# EAGLE board en_v5 (EAGLE 9.6.2), part 1 of 2
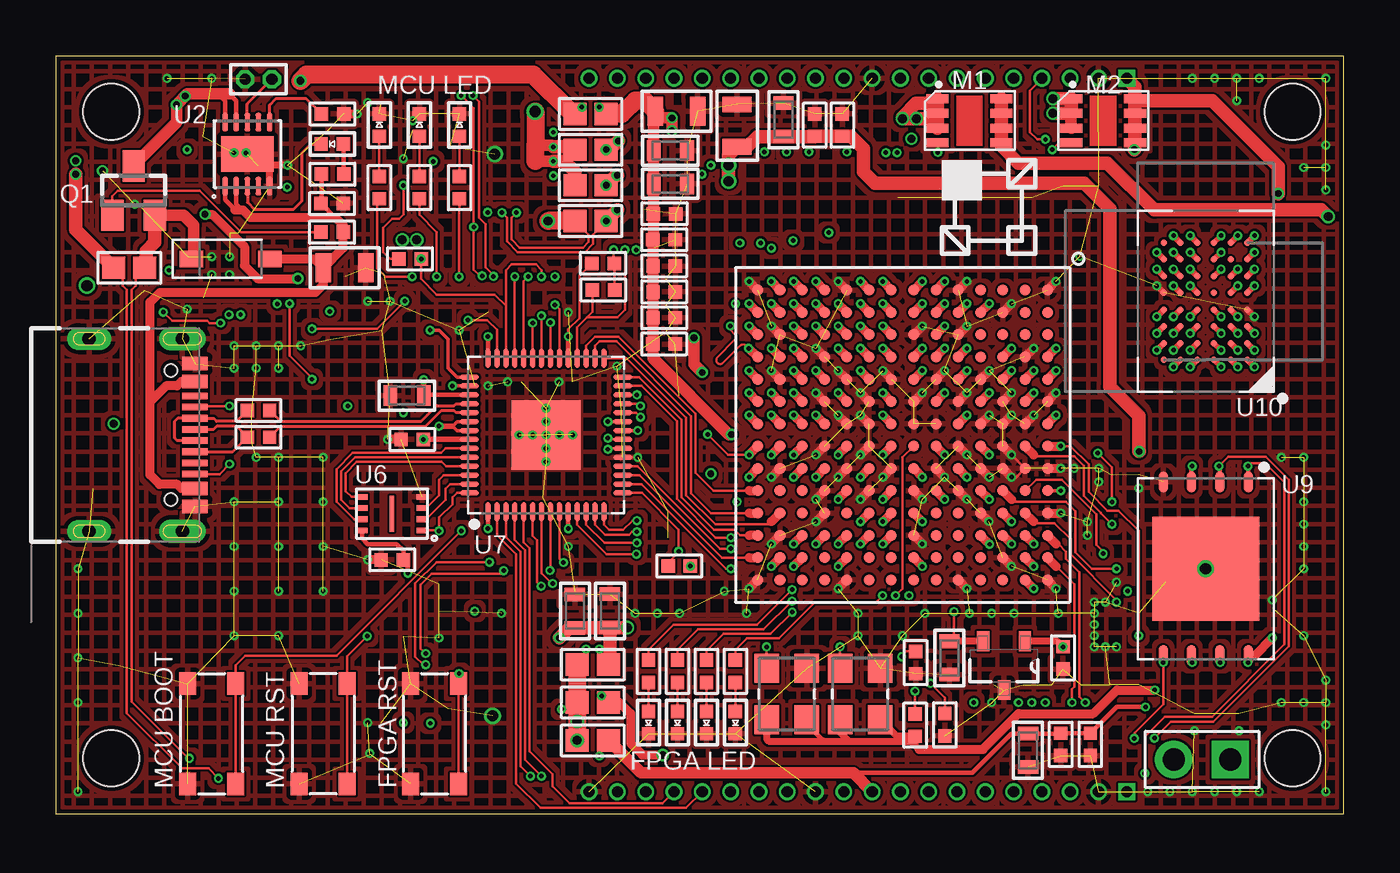
[diagram p6: board, top side]
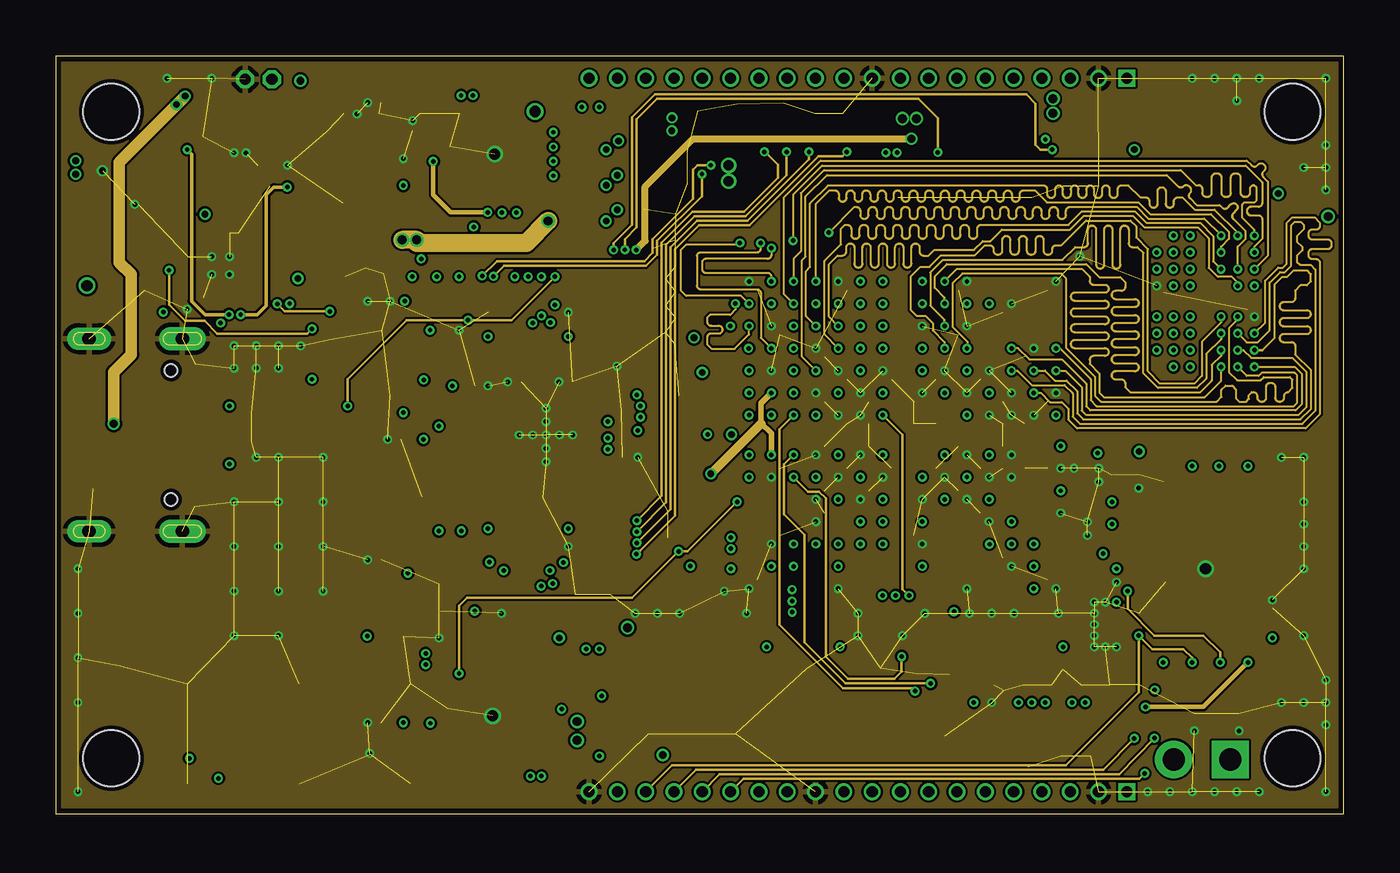
[diagram p7: board, inner layer Route2]
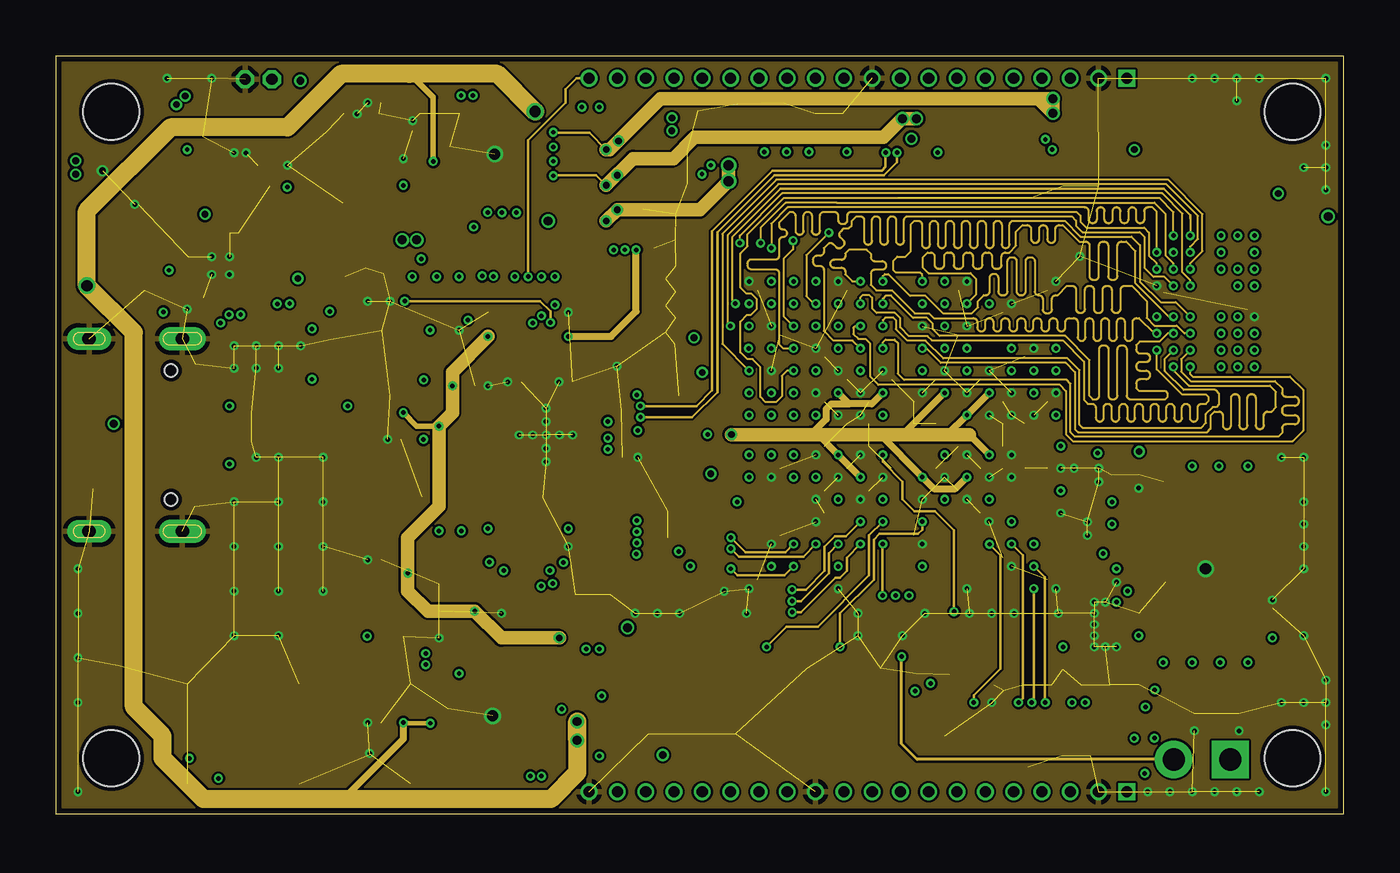
[diagram p8: board, inner layer Route3]
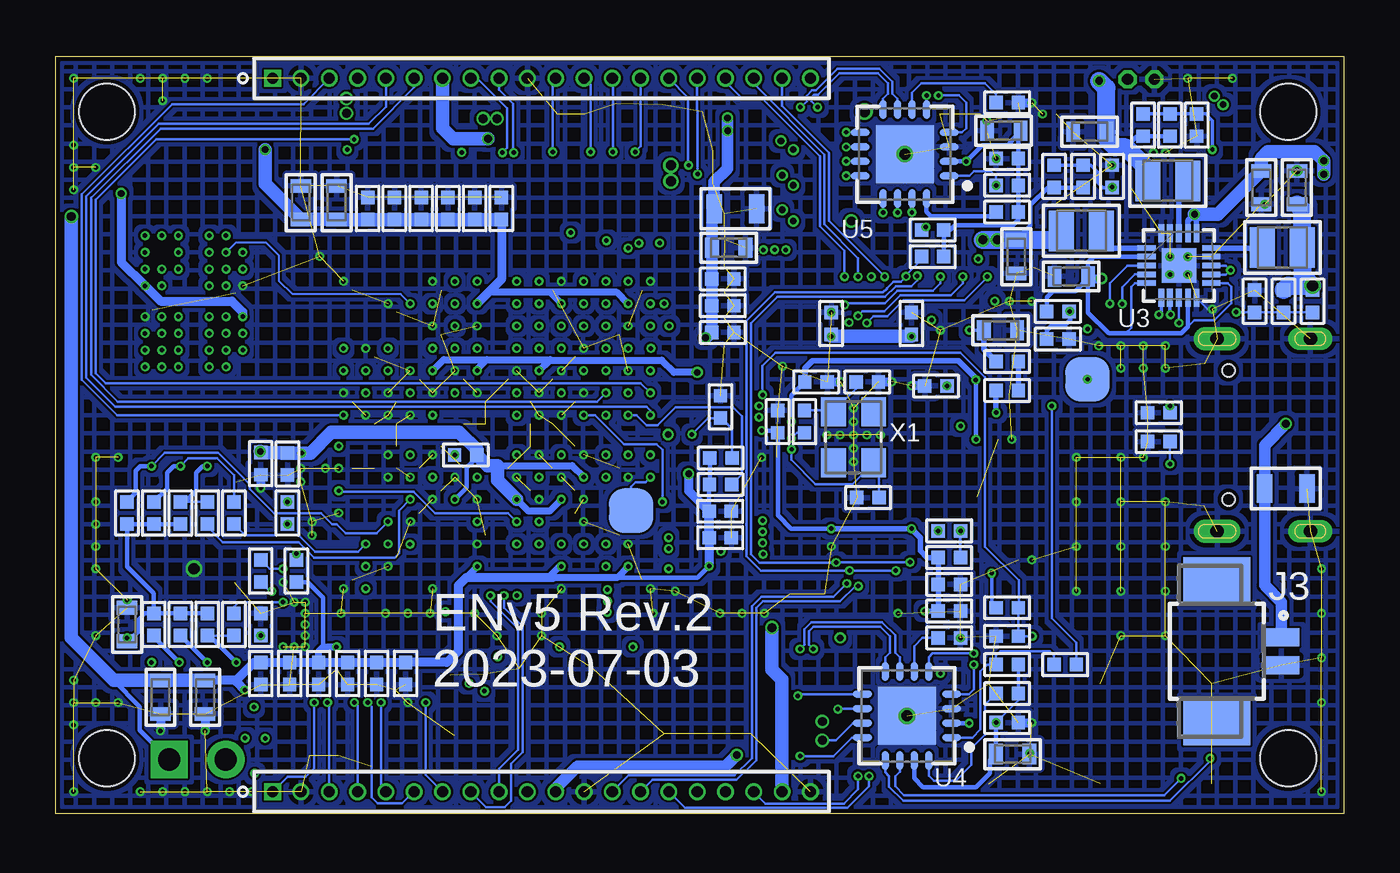
[diagram p9: board, bottom side, seen from below]

Size 57.8 x 34 mm. Coordinates in mm from the lower left corner, seen from the top.
Outline: 0,0 57.8,0 57.8,34 0,34 0,0
Copper layers (1+2*3+16): Top 0.018mm / dielectric 0.36mm / Route2 0.035mm / dielectric 0.71mm / Route3 0.035mm / dielectric 0.36mm / Bottom 0.018mm
Design rules "Multi-CB_4L_100Êm-Tracks_OL35Êm-IL35Êm": minimum track width 0.1mm, minimum drill 0.2mm, track to track 0.1mm, track to pad 0.1mm, pad to pad 0.1mm, via to via 0.1mm, smd to smd 0mil, copper to edge 0.2mm, drill to drill 0.2mm, minimum pad ring 0.125mm, minimum via ring 0.1mm, stop-mask expansion 2mil, vias tented up to drill 0.45mm, thermal gap 0.2mm
Net classes: 1 diff pairs: width 0.102 mm
Holes 2.5 mm at 2.5,31.5 2.5,2.5 55.5,31.5 55.5,2.5

## Footprints (pad centres in the part's own frame; a part is rotated, then mirrored left to right if it is on the bottom)
0805 = smd 0.7 x 1.3: 1 -0.95,0; 2 0.95,0
0402 = smd 0.6 x 0.6: 1 -0.5,0; 2 0.5,0
CAPC1608-0603 = smd 0.611 x 0.912: 1 -0.751,0; 2 0.751,0
SOD-123 = smd 1.046 x 0.739: 1 -1.762,0; 2 1.762,0
20X1_HEADER_THT_1.27MM = drill 0.5 pad 0.61 square: 1 -12.065,0 | drill 0.5 pad 0.61: 2 -10.795,0; 3 -9.525,0; 4 -8.255,0; 5 -6.985,0; 6 -5.715,0; 7 -4.445,0; 8 -3.175,0; 9 -1.905,0; 10 -0.635,0; 11 0.635,0; 12 1.905,0; 13 3.175,0; 14 4.445,0; 15 5.715,0; 16 6.985,0; 17 8.255,0; 18 9.525,0; 19 10.795,0; 20 12.065,0
MOLEX_53261-0271 = smd 0.8 x 1.6: 1 -0.625,2.9; 2 0.625,2.9 | smd 2.1 x 3: P1 -3.175,0; P2 3.175,0
GCT_USB4105-GF-A = smd 0.6 x 1.15: A1_B12 -3.2,4.755; A4_B9 -2.4,4.755; B1_A12 3.2,4.755; B4_A9 2.4,4.755 | smd 0.3 x 1.15: A5 -1.25,4.755; A6 -0.25,4.755; A7 0.25,4.755; A8 1.25,4.755; B5 1.75,4.755; B6 0.75,4.755; B7 -0.75,4.755; B8 -1.75,4.755 | drill 0.6 pad 1.05 long: S1 -4.32,4.18; S4 4.32,4.18 | drill 0.6 pad 1 long: S2 -4.32,0; S3 4.32,0 | hole 0.55: 2.89,3.68; -2.89,3.68
2X1_HEADER = drill 1 pad 1.676 square: 1 0,3.81 | drill 1 pad 1.676: 3 0,1.27
INDC2016X120N = smd 1.121 x 1.815: 1 -0.897,0; 2 0.897,0
POWERPAK1212-8 = smd 0.405 x 0.99: 1 -0.99,-1.435; 2 -0.33,-1.435; 3 0.33,-1.435; 4 0.99,-1.435; 5 0.99,1.435; 6 0.33,1.435; 7 -0.33,1.435; 8 -0.99,1.435
SSOT-3 = smd 1 x 1.4: 1 -0.95,-1.1; 2 0.95,-1.1; 3 0,1.1
THT_2 = drill 0.5 pad 0.813 octagon: P$1 -0.6,0; P$2 0.6,0
0603 = smd 1.029 x 0.999: 1 -0.7,0; 2 0.7,0
TACTILE-SWITCH = smd 1 x 0.75: 1 -2.25,-1.075; 2 2.25,-1.075; 3 -2.25,1.075; 4 2.25,1.075
SMD_PAD = smd 2 x 2: 1 0,0
SOT-23(3PIN) = smd 0.559 x 0.889: 1 -0.94,-1.092; 2 0.94,-1.092; 3 0,1.092
DFN-10(3X3X0.9) = smd 0.84 x 0.26: 1 -1.435,1; 2 -1.435,0.5; 3 -1.435,0; 4 -1.435,-0.5; 5 -1.435,-1; 6 1.435,-1; 7 1.435,-0.5; 8 1.435,0; 9 1.435,0.5; 10 1.435,1 | smd 1.58 x 2.35: 11 0,0
QFN40P300X300X80-21N = smd 0.813 x 0.254: 1 -1.448,0.787; 2 -1.448,0.406; 3 -1.448,0; 4 -1.448,-0.406; 5 -1.448,-0.787; 11 1.448,-0.787; 12 1.448,-0.406; 13 1.448,0; 14 1.448,0.406; 15 1.448,0.787 | smd 0.254 x 0.813: 6 -0.787,-1.448; 7 -0.406,-1.448; 8 0,-1.448; 9 0.406,-1.448; 10 0.787,-1.448; 16 0.787,1.448; 17 0.406,1.448; 18 0,1.448; 19 -0.406,1.448; 20 -0.787,1.448 | smd 1.549 x 1.549: 21 0,0
UQFN-16(4×4×0.5MM) = smd 0.86 x 0.32: 1 -2,0.975; 2 -2,0.325; 3 -2,-0.325; 4 -2,-0.975; 9 2,-0.975; 10 2,-0.325; 11 2,0.325; 12 2,0.975 | smd 0.32 x 0.86: 5 -0.975,-2; 6 -0.325,-2; 7 0.325,-2; 8 0.975,-2; 13 0.975,2; 14 0.325,2; 15 -0.325,2; 16 -0.975,2 | smd 2.6 x 2.6: 17 0,0
USON8-2X3MM = smd 0.5 x 0.25: 1 -1.35,0.75; 2 -1.35,0.25; 3 -1.35,-0.25; 4 -1.35,-0.75; 5 1.35,-0.75; 6 1.35,-0.25; 7 1.35,0.25; 8 1.35,0.75 | smd 0.2 x 1.6: 9 0,0
QFN40P700X700X100-57T310N = smd 0.858 x 0.218: 1 -3.442,2.6; 2 -3.442,2.2; 3 -3.442,1.8; 4 -3.442,1.4; 5 -3.442,1; 6 -3.442,0.6; 7 -3.442,0.2; 8 -3.442,-0.2; 9 -3.442,-0.6; 10 -3.442,-1; 11 -3.442,-1.4; 12 -3.442,-1.8; 13 -3.442,-2.2; 14 -3.442,-2.6; 29 3.442,-2.6; 30 3.442,-2.2; 31 3.442,-1.8; 32 3.442,-1.4; 33 3.442,-1; 34 3.442,-0.6; 35 3.442,-0.2; 36 3.442,0.2; 37 3.442,0.6; 38 3.442,1; 39 3.442,1.4; 40 3.442,1.8; 41 3.442,2.2; 42 3.442,2.6 | smd 0.218 x 0.858: 15 -2.6,-3.442; 16 -2.2,-3.442; 17 -1.8,-3.442; 18 -1.4,-3.442; 19 -1,-3.442; 20 -0.6,-3.442; 21 -0.2,-3.442; 22 0.2,-3.442; 23 0.6,-3.442; 24 1,-3.442; 25 1.4,-3.442; 26 1.8,-3.442; 27 2.2,-3.442; 28 2.6,-3.442; 43 2.6,3.442; 44 2.2,3.442; 45 1.8,3.442; 46 1.4,3.442; 47 1,3.442; 48 0.6,3.442; 49 0.2,3.442; 50 -0.2,3.442; 51 -0.6,3.442; 52 -1,3.442; 53 -1.4,3.442; 54 -1.8,3.442; 55 -2.2,3.442; 56 -2.6,3.442 | smd 3.1 x 3.1: 57 0,0
FTGB196 = smd 0.5 x 0.5: A1 -6.5,6.5; A2 -5.5,6.5; A3 -4.5,6.5; A4 -3.5,6.5; A5 -2.5,6.5; A6 -1.5,6.5; A7 -0.5,6.5; A8 0.5,6.5; A9 1.5,6.5; A10 2.5,6.5; A11 3.5,6.5; A12 4.5,6.5; A13 5.5,6.5; A14 6.5,6.5; B1 -6.5,5.5; B2 -5.5,5.5; B3 -4.5,5.5; B4 -3.5,5.5; B5 -2.5,5.5; B6 -1.5,5.5; B7 -0.5,5.5; B8 0.5,5.5; B9 1.5,5.5; B10 2.5,5.5; B11 3.5,5.5; B12 4.5,5.5; B13 5.5,5.5; B14 6.5,5.5; C1 -6.5,4.5; C2 -5.5,4.5; C3 -4.5,4.5; C4 -3.5,4.5; C5 -2.5,4.5; C6 -1.5,4.5; C7 -0.5,4.5; C8 0.5,4.5; C9 1.5,4.5; C10 2.5,4.5; C11 3.5,4.5; C12 4.5,4.5; C13 5.5,4.5; C14 6.5,4.5; D1 -6.5,3.5; D2 -5.5,3.5; D3 -4.5,3.5; D4 -3.5,3.5; D5 -2.5,3.5; D6 -1.5,3.5; D7 -0.5,3.5; D8 0.5,3.5; D9 1.5,3.5; D10 2.5,3.5; D11 3.5,3.5; D12 4.5,3.5; D13 5.5,3.5; D14 6.5,3.5; E1 -6.5,2.5; E2 -5.5,2.5; E3 -4.5,2.5; E4 -3.5,2.5; E5 -2.5,2.5; E6 -1.5,2.5; E7 -0.5,2.5; E8 0.5,2.5; E9 1.5,2.5; E10 2.5,2.5; E11 3.5,2.5; E12 4.5,2.5; E13 5.5,2.5; E14 6.5,2.5; F1 -6.5,1.5; F2 -5.5,1.5; F3 -4.5,1.5; F4 -3.5,1.5; F5 -2.5,1.5; F6 -1.5,1.5; F7 -0.5,1.5; F8 0.5,1.5; F9 1.5,1.5; F10 2.5,1.5; F11 3.5,1.5; F12 4.5,1.5; F13 5.5,1.5; F14 6.5,1.5; G1 -6.5,0.5; G2 -5.5,0.5; G3 -4.5,0.5; G4 -3.5,0.5; G5 -2.5,0.5; G6 -1.5,0.5; G7 -0.5,0.5; G8 0.5,0.5; G9 1.5,0.5; G10 2.5,0.5; G11 3.5,0.5; G12 4.5,0.5; G13 5.5,0.5; G14 6.5,0.5; H1 -6.5,-0.5; H2 -5.5,-0.5; H3 -4.5,-0.5; H4 -3.5,-0.5; H5 -2.5,-0.5; H6 -1.5,-0.5; H7 -0.5,-0.5; H8 0.5,-0.5; H9 1.5,-0.5; H10 2.5,-0.5; H11 3.5,-0.5; H12 4.5,-0.5; H13 5.5,-0.5; H14 6.5,-0.5; J1 -6.5,-1.5; J2 -5.5,-1.5; J3 -4.5,-1.5; J4 -3.5,-1.5; J5 -2.5,-1.5; J6 -1.5,-1.5; J7 -0.5,-1.5; J8 0.5,-1.5; J9 1.5,-1.5; J10 2.5,-1.5; J11 3.5,-1.5; J12 4.5,-1.5; J13 5.5,-1.5; J14 6.5,-1.5; K1 -6.5,-2.5; K2 -5.5,-2.5; K3 -4.5,-2.5; K4 -3.5,-2.5; K5 -2.5,-2.5; K6 -1.5,-2.5; K7 -0.5,-2.5; K8 0.5,-2.5; K9 1.5,-2.5; K10 2.5,-2.5; K11 3.5,-2.5; K12 4.5,-2.5; K13 5.5,-2.5; K14 6.5,-2.5; L1 -6.5,-3.5; L2 -5.5,-3.5; L3 -4.5,-3.5; L4 -3.5,-3.5; L5 -2.5,-3.5; L6 -1.5,-3.5; L7 -0.5,-3.5; L8 0.5,-3.5; L9 1.5,-3.5; L10 2.5,-3.5; L11 3.5,-3.5; L12 4.5,-3.5; L13 5.5,-3.5; L14 6.5,-3.5; M1 -6.5,-4.5; M2 -5.5,-4.5; M3 -4.5,-4.5; M4 -3.5,-4.5; M5 -2.5,-4.5; M6 -1.5,-4.5; M7 -0.5,-4.5; M8 0.5,-4.5; M9 1.5,-4.5; M10 2.5,-4.5; M11 3.5,-4.5; M12 4.5,-4.5; M13 5.5,-4.5; M14 6.5,-4.5; N1 -6.5,-5.5; N2 -5.5,-5.5; N3 -4.5,-5.5; N4 -3.5,-5.5; N5 -2.5,-5.5; N6 -1.5,-5.5; N7 -0.5,-5.5; N8 0.5,-5.5; N9 1.5,-5.5; N10 2.5,-5.5; N11 3.5,-5.5; N12 4.5,-5.5; N13 5.5,-5.5; N14 6.5,-5.5; P1 -6.5,-6.5; P2 -5.5,-6.5; P3 -4.5,-6.5; P4 -3.5,-6.5; P5 -2.5,-6.5; P6 -1.5,-6.5; P7 -0.5,-6.5; P8 0.5,-6.5; P9 1.5,-6.5; P10 2.5,-6.5; P11 3.5,-6.5; P12 4.5,-6.5; P13 5.5,-6.5; P14 6.5,-6.5
WSON6X8MM = smd 0.938 x 0.42: 1 -3.896,1.905; 2 -3.896,0.635; 3 -3.896,-0.635; 4 -3.896,-1.905; 5 3.896,-1.905; 6 3.896,-0.635; 7 3.896,0.635; 8 3.896,1.905 | smd 4.65 x 4.8: 9 0,0
BGA-48 = smd 0.3 x 0.3: A1 -1.875,2.625; A2 -1.125,2.625; A3 -0.375,2.625; A4 0.375,2.625; A5 1.125,2.625; A6 1.875,2.625; B1 -1.875,1.875; B2 -1.125,1.875; B3 -0.375,1.875; B4 0.375,1.875; B5 1.125,1.875; B6 1.875,1.875; C1 -1.875,1.125; C2 -1.125,1.125; C3 -0.375,1.125; C4 0.375,1.125; C5 1.125,1.125; C6 1.875,1.125; D1 -1.875,0.375; D2 -1.125,0.375; D3 -0.375,0.375; D4 0.375,0.375; D5 1.125,0.375; D6 1.875,0.375; E1 -1.875,-0.375; E2 -1.125,-0.375; E3 -0.375,-0.375; E4 0.375,-0.375; E5 1.125,-0.375; E6 1.875,-0.375; F1 -1.875,-1.125; F2 -1.125,-1.125; F3 -0.375,-1.125; F4 0.375,-1.125; F5 1.125,-1.125; F6 1.875,-1.125; G1 -1.875,-1.875; G2 -1.125,-1.875; G3 -0.375,-1.875; G4 0.375,-1.875; G5 1.125,-1.875; G6 1.875,-1.875; H1 -1.875,-2.625; H2 -1.125,-2.625; H3 -0.375,-2.625; H4 0.375,-2.625; H5 1.125,-2.625; H6 1.875,-2.625
3.2X2.5_OSC = smd 1.3 x 1.1: 1 -1.15,-0.9; 2 1.15,-0.9; 3 1.15,0.9; 4 -1.15,0.9

## Placement (x,y rotation side)
C1  10uF  [0805]  12.96,24.5 180 top
C2  10uF  [0805]  2.6,14.6 0 bottom
C3  0.1uF  [0402]  45.2,7 90 top
C4  10uF  [CAPC1608-0603]  40.1,7 90 top
C5  10uF  [CAPC1608-0603]  3.7,28.1 270 bottom
C6  10uF  [CAPC1608-0603]  12.23,24.11 180 bottom
C7  6.8pF  [0402]  7.8,30.9 90 bottom
C8  10uF  [CAPC1608-0603]  11.4,30.6 0 bottom
C9  3.3pF  [0402]  11.7,28.6 90 bottom
C10  10uF  [CAPC1608-0603]  14.7,25 270 bottom
C11  2.7pF  [0402]  2.7,23 270 bottom
C12  10uF  [CAPC1608-0603]  2.1,28.1 90 bottom
C13  4.7uF  [CAPC1608-0603]  15.26,30.65 180 bottom
C14  0.1uF  [0402]  15.1,29.4 180 bottom
C15  4.7uF  [CAPC1608-0603]  14.86,2.69 0 bottom
C16  0.1uF  [0402]  15.1,4.1 0 bottom
C17  4.7uF  [CAPC1608-0603]  24.87,9.11 90 top
C18  0.1uF  [0402]  18.3,19.2 0 bottom
C19  0.1uF  [0402]  19.4,22 90 bottom
C20  0.1uF  [0402]  25.4,17.6 90 bottom
C21  0.1uF  [0402]  17.7,9.1 0 bottom
C22  0.1uF  [0402]  17.7,10.3 0 bottom
C23  0.1uF  [0402]  23,22 90 bottom
C24  0.1uF  [0402]  16,16.8 180 top
C25  4.7uF  [CAPC1608-0603]  15.76,18.77 180 top
C26  0.1uF  [0402]  23.68,19.38 180 bottom
C27  0.1uF  [0402]  15.1,7.97 180 bottom
C28  4.7uF  [CAPC1608-0603]  15.4,21.7 0 bottom
C29  4.7uF  [CAPC1608-0603]  23.3,9.1 90 top
C30  0.1uF  [0402]  15.1,11.4 180 top
C31  20pF  [0402]  21.35,14.19 180 bottom
C32  20pF  [0402]  21.38,19.38 0 bottom
C33  1uF  [0402]  27.97,18.26 270 bottom
C34  4.7uF  [CAPC1608-0603]  53.1,5.24 90 bottom
C35  4.7uF  [CAPC1608-0603]  51.1,5.24 90 bottom
C36  470nF  [0402]  46,6.3 90 bottom
C37  470nF  [0402]  44.7,6.3 90 bottom
C38  470nF  [0402]  47.3,6.3 90 bottom
C39  470nF  [0402]  48.6,6.3 90 bottom
C40  47nF  [0402]  42.1,6.3 90 bottom
C41  47nF  [0402]  43.4,6.3 90 bottom
C42  10uF  [CAPC1608-0603]  43.63,2.86 90 top
C43  1uF  [0402]  46.43,3.12 90 top
C44  0.1uF  [0402]  45.1,3.12 90 top
C45  4.7uF  [CAPC1608-0603]  45.2,27.42 270 bottom
C46  4.7uF  [CAPC1608-0603]  46.8,27.42 270 bottom
C47  470nF  [0402]  42.6,27.16 270 bottom
C48  470nF  [0402]  40.2,27.16 270 bottom
C49  470nF  [0402]  41.4,27.16 270 bottom
C50  470nF  [0402]  43.8,27.16 270 bottom
C51  47nF  [0402]  37.8,27.16 270 bottom
C52  47nF  [0402]  39,27.16 270 bottom
C53  47uF  [0805]  30.58,30.88 270 top
C54  4.7uF  [CAPC1608-0603]  32.66,31.14 270 top
C55  470nF  [0402]  34.06,30.9 270 top
C56  470nF  [0402]  35.3,30.9 270 top
C57  47nF  [0402]  47.4,15.7 90 bottom
C58  47nF  [0402]  48.6,15.72 90 bottom
C59  100uF  [0805]  27.86,31.52 180 top
C60  4.7uF  [CAPC1608-0603]  27.58,28.26 180 top
C61  4.7uF  [CAPC1608-0603]  27.58,29.76 180 top
C62  470nF  [0402]  27.3,24.58 180 top
C63  470nF  [0402]  27.3,23.42 180 top
C64  470nF  [0402]  27.3,22.26 180 top
C65  47nF  [0402]  27.3,21.08 180 top
C66  47nF  [0402]  27.3,25.76 180 top
C67  47nF  [0402]  27.32,26.92 180 top
C68  4.7uF  [CAPC1608-0603]  54.6,8.5 90 bottom
C69  47uF  [0805]  27.3,27.15 180 bottom
C70  4.7uF  [CAPC1608-0603]  27.6,25.4 180 bottom
C71  470nF  [0402]  27.86,24 180 bottom
C72  47nF  [0402]  27.86,21.6 180 bottom
C73  47nF  [0402]  27.86,22.8 180 bottom
C74  470nF  [0402]  27.98,13.58 180 bottom
C75  47nF  [0402]  27.98,12.39 180 bottom
D1  DIODEB5817W  [SOD-123]  7.85,24.9 0 top
D2  green  [0402]  12.41,30.05 180 top
D3  red  [0402]  18.12,30.9 90 top
D4  red  [0402]  16.32,30.9 90 top
D5  red  [0402]  14.52,30.9 90 top
D6  red  [0402]  30.5,4.1 270 top
D7  red  [0402]  29.2,4.1 270 top
D8  red  [0402]  27.9,4.1 270 top
D9  red  [0402]  26.6,4.1 270 top
J1  M50-3142045THT  [20X1_HEADER_THT_1.27MM]  36,1 0 bottom
J2  M50-3142045THT  [20X1_HEADER_THT_1.27MM]  36,33 0 bottom
J3  53261-0271  [MOLEX_53261-0271]  5.7,7.3 270 bottom
J4  USB4105-GF-A  [GCT_USB4105-GF-A]  1.5,17 270 top
J5  FEMALE_HEADER_2X1  [2X1_HEADER]  48.9,2.45 270 top
L1  1.5uH(MLP2016H1R5MT0S1)  [INDC2016X120N]  7.9,28.4 180 bottom
L2  3.3uH(MLP2016H3R3MT0S1)  [INDC2016X120N]  11.78,26.16 180 bottom
L3  2.2uH(MLP2016H2R2MT0S1)  [INDC2016X120N]  2.75,25.41 180 bottom
M1  SISS23DN  [POWERPAK1212-8]  41,31.1 270 top
M2  SISS23DN  [POWERPAK1212-8]  47,31.1 270 top
Q1  FDN302P  [SSOT-3]  3.5,27.96 0 top
R1  5K  [0402]  8.3,18 180 bottom
R2  5K  [0402]  8.3,16.7 0 bottom
R3  10K  [0402]  12.4,27.39 0 top
R4  10K  [0402]  12.4,26.1 0 top
R5  2K  [0402]  12.42,31.4 0 top
R6  1K  [0402]  12.42,28.7 0 top
R7  NTCLE413E2103H400  [THT_2]  9.1,32.95 0 top
R8  30K  [0402]  9,30.9 90 bottom
R9  120K  [0402]  6.6,30.9 270 bottom
R10  0R  [0402]  12.83,22.54 180 bottom
R11  150K  [0402]  13,28.6 90 bottom
R12  120K  [0402]  10.4,28.6 90 bottom
R13  120K  [0402]  12.83,21.3 180 bottom
R14  180K  [0402]  1.4,23 270 bottom
R15  57.6K  [0402]  4,23 90 bottom
R16  0.82R  [0603]  24.1,3.3 180 top
R17  0.82R  [0603]  24,28.2 180 top
R18  0.82R  [0603]  24,26.6 180 top
R19  0.82R  [0603]  3.3,24.5 0 top
R20  0.82R  [0603]  24.1,6.7 180 top
R21  0.82R  [0603]  24,31.4 180 top
R22  10K  [0402]  15.1,5.4 180 bottom
R23  10K  [0402]  15.1,27 180 bottom
R24  10K  [0402]  15.1,6.7 180 bottom
R25  10K  [0402]  15.1,28.2 180 bottom
R26  0.82R  [0603]  24.1,5 180 top
R27  0R  [0402]  12.5,6.7 180 bottom
R28  0.82R  [0603]  24,29.8 180 top
R29  0R  [0402]  15.9,24.9 180 top
R30  499R  [0402]  17.7,7.9 180 bottom
R31  806R  [0402]  15.1,31.91 180 bottom
R32  4.7K  [0402]  18.45,26.2 180 bottom
R33  100R  [0402]  24.58,23.5 180 top
R34  10K  [0402]  24.56,24.7 0 top
R35  4.7K  [0402]  18.45,25 180 bottom
R36  499R  [0402]  18.12,28.1 90 top
R37  200R  [0402]  15.1,19 180 bottom
R38  499R  [0402]  16.32,28.1 90 top
R39  499R  [0402]  15.1,9.25 180 bottom
R40  499R  [0402]  14.52,28.1 90 top
R41  1R  [0402]  15.1,20.3 0 bottom
R42  27R  [0402]  9.1,16.9 180 top
R43  27R  [0402]  9.1,18.1 180 top
R44  10K  [0402]  17.7,11.5 180 bottom
R45  2K  [0402]  17.7,12.7 0 bottom
R46  1K  [0402]  24.2,17.6 90 bottom
R47  0R  [0402]  47.4,13.5 90 bottom
R48  0R  [0402]  39.4,16.1 0 bottom
R49  0R  [0402]  27.96,14.78 180 bottom
R50  2K  [0402]  27.95,15.97 0 bottom
R51  1K  [0402]  47,10.9 270 bottom
R52  1K  [0402]  38.59,6.79 90 top
R53  2K  [0402]  53.4,8.5 270 bottom
R54  1K  [0402]  39.9,4 90 top
R55  1K  [0402]  38.56,3.99 90 top
R56  2K  [0402]  52.2,13.5 90 bottom
R57  2K  [0402]  53.4,13.5 90 bottom
R58  2K  [0402]  51,8.5 270 bottom
R59  4.7K  [0402]  54.6,13.5 90 bottom
R60  100R  [0402]  52.2,8.5 270 bottom
R61  100R  [0402]  48.6,8.5 90 bottom
R62  1K  [0402]  27.98,11.12 0 top
R63  499R  [0402]  30.5,6.4 270 top
R64  499R  [0402]  29.2,6.4 270 top
R65  100R  [0402]  49.8,8.5 270 bottom
R66  100R  [0402]  49.8,13.5 90 bottom
R67  499R  [0402]  27.9,6.4 270 top
R68  100R  [0402]  51,13.5 90 bottom
R69  499R  [0402]  26.6,6.4 270 top
R70  100R  [0402]  48.6,10.9 270 bottom
S1  TACTILE-SWITCH  [TACTILE-SWITCH]  12,3.6 270 top
S2  TACTILE-SWITCH  [TACTILE-SWITCH]  7,3.6 90 top
S3  TACTILE-SWITCH  [TACTILE-SWITCH]  17,3.6 90 top
TP1  TEST_POINTSMD  [SMD_PAD]  31.98,13.61 0 bottom
TP2  TEST_POINTSMD  [SMD_PAD]  11.5,19.5 0 bottom
U1  REF3012AIDBZR  [SOT-23(3PIN)]  42.55,6.65 180 top
U2  MCP73833T-AMI/MF  [DFN-10(3X3X0.9)]  8.6,29.6 90 top
U3  LTC3569EUDPBF  [QFN40P300X300X80-21N]  7.4,24.6 0 bottom
U4  PAC1934  [UQFN-16(4×4×0.5MM)]  19.6,4.4 180 bottom
U5  PAC1934  [UQFN-16(4×4×0.5MM)]  19.7,29.6 180 bottom
U6  W25Q16JVUXIQ  [USON8-2X3MM]  15.09,13.47 180 top
U7  RP2040  [QFN40P700X700X100-57T310N]  22,17 90 top
U8  SPARTAN7-LX15  [FTGB196]  38,17 270 top
U9  S25FL256S  [WSON6X8MM]  51.6,11 270 top
U10  CY7C1051DV33  [BGA-48]  51.6,23 180 top
X1  12MHz  [3.2X2.5_OSC]  22,16.9 90 bottom
X2  32MHz  [3.2X2.5_OSC]  36.1,5.38 90 top
X3  100MHz  [3.2X2.5_OSC]  32.8,5.38 90 top

## Tracks (layer width: path | path; a pad name or v marks a point on that pad's centre or on a via)
!EN_PWR_SRAM  (via drill 0.2)
  Top 0.102: R33.1 25.08,24.68 R34.2 25.04,24.72 v25.04,25.3 | v44.72,29.8 45.02,30.11 M2.4
  Route2 0.102: v25.04,25.3 25.04,25.61 25.86,26.43 25.86,31.25 26.89,32.28 43.56,32.28 43.97,31.87 43.97,30.03 44.2,29.8 v44.72,29.8
!MCU_RST  (via drill 0.2)
  Top 0.102: U7.26 v26.08,18.8 | S1.4 S1.3 13.07,7.08 v13.98,7.98
  Bottom 0.102: v26.08,18.8 v26.09,18.8 26.09,20.11 25.51,20.69 17.2,20.69 16.1,19.59 16.1,12 14.59,10.48 14.59,9.28 14.6,9.27 R39.1 C27.1 v13.98,7.98
!USB_BOOT  (via drill 0.2)
  Top 0.102: R45.1 12.6,7.09 8.49,7.09 8.07,6.67 S2.2 S2.1
  other vias: 18.2,12.7
ADC_AVDD  (via drill 0.2)
  Top 0.152: U7.43 18,19.6 17.6,20 17.6,21.3 17.2,21.7 v16.8,21.7
  Bottom 0.152: C28.1 v16.8,21.7
  Bottom 0.254: R41.1 16.15,20.85 C28.1
ADC_VREF
  Bottom 0.254: R37.1 R41.2
FADC_VN  (via drill 0.2)
  Top 0.406: U8.H7 v37.11,17.89
  Route2 0.102: v37.11,17.89 38,17 38,10.09 v38.29,9.8
  Bottom 0.102: v38.29,9.8 38.29,9.55 37.05,8.31 37.05,2.88 37.91,2.03 J1.9
FADC_VP  (via drill 0.2)
  Top 0.102: U8.G8 38,16 38,10.11 v37.69,9.8
  Bottom 0.102: v37.69,9.8 37.69,9.26 36.85,8.42 36.85,2.76 37.36,2.25 37.36,0.6 37.66,0.3 38.49,0.3 39.17,0.99 J1.8
FIO_0  (via drill 0.2)
  Top 0.102: v46.2,5 45.94,5.26 45.94,10.85 45.34,11.45 45.34,11.76 44.99,12.11 44.89,12.11
  Top 0.406: 44.89,12.11 U8.A12
  Bottom 0.102: v46.2,5 46.2,2.06 46.58,1.68 47.38,1.68 J1.1
FIO_1  (via drill 0.2)
  Top 0.102: v45.6,5 45.6,5.59 45.72,5.71 45.72,10.3 44.9,11.11 44.89,11.11
  Top 0.406: 44.89,11.11 U8.A13
  Bottom 0.102: v45.6,5 45.52,4.92 J1.3
FIO_2  (via drill 0.2)
  Top 0.406: U8.B13 v43.89,11.11
  Route3 0.102: v43.89,11.11 44.39,10.61 v44.39,5.01 v44.4,5
  Bottom 0.102: J1.4 44.26,4.86 v44.4,5
FIO_3  (via drill 0.2)
  Top 0.406: U8.C12 v42.89,12.11
  Route3 0.102: v43.2,5 43.4,5.2 43.4,11.6 v42.89,12.11
  Bottom 0.102: v43.2,5 43.2,1.22 J1.5
FIO_4  (via drill 0.2)
  Top 0.406: U8.B14 v43.89,10.11
  Route3 0.102: v43.8,5 43.89,5.09 v43.89,10.11
  Bottom 0.102: v43.8,5 43.8,4.98 43.63,4.81 43.63,0.74 43.36,0.47 42.25,0.47 J1.6
FIO_5  (via drill 0.2)
  Top 0.406: U8.D12 v41.9,12.1
  Route3 0.102: v41.2,5 41.2,5.32 42.4,6.51 42.4,11.6 v41.9,12.1
  Bottom 0.102: v41.2,5 41.2,1.75 J1.7
FLASH_DQ0  (via drill 0.2)
  Top 0.102: v47.6,9.5 47.6,9.59 45.55,11.64 45.55,12.32 44.82,13.05 43.95,13.05 43.89,13.11
  Top 0.406: U8.B11 43.89,13.11
  Bottom 0.102: R65.1 49.8,9.3 49.6,9.5 v47.6,9.5
FLASH_DQ1  (via drill 0.2)
  Top 0.406: U8.B12 v43.89,12.11
  Bottom 0.102: R66.1 49.3,12.5 46.9,12.5 46.16,11.76 44.24,11.76 v43.89,12.11
FLASH_DQ2  (via drill 0.2)
  Top 0.406: U8.D10 v41.89,14.11
  Bottom 0.102: R68.1 51,12.9 50.3,12.2 46.9,12.2 46.2,11.5 42.6,11.5 42.4,11.7 42.4,13.6 v41.89,14.11
FLASH_DQ3  (via drill 0.2)
  Top 0.102: v47.6,11 46.5,11 45.76,11.74 45.76,13.57 45.33,14 43,14 42.89,14.11
  Top 0.406: U8.C10 42.89,14.11
  Bottom 0.102: R70.1 48.2,11 v47.6,11
FPGA_DONE  (via drill 0.2)
  Top 0.406: U8.P9 v31.11,15.11
  Bottom 0.102: v31.11,15.11 31.33,14.89 31.77,14.89 31.98,14.68 TP1.1
FPGA_INT_B  (via drill 0.2)
  Top 0.102: v29.25,17.03 30.17,16.11 v31.11,16.11
  Top 0.406: U8.P8 v31.11,16.11
  Bottom 0.102: R50.2 27.45,17.31 C33.2 28.52,17.76 v29.25,17.03
FPGA_LED0  (via drill 0.2)
  Top 0.102: v37.1,9.8 36.8,9.5 34.08,9.5 32.45,7.88 31.02,7.88 30.5,7.36 R63.1
  Top 0.406: U8.H12 v37.11,12.11
  Route3 0.102: v37.11,12.11 v37.1,12.1 v37.1,9.8
FPGA_LED1  (via drill 0.2)
  Top 0.102: v33.05,9.05 32.08,8.08 29.96,8.08 29.2,7.32 R64.1
  Top 0.406: U8.J12 v36.11,12.11
  Route3 0.102: v36.11,12.11 35.5,11.5 35.5,10.9 35.2,10.6 34.98,10.6 33.44,9.05 v33.05,9.05
FPGA_LED2  (via drill 0.2)
  Top 0.102: v33.04,9.55 31.77,8.28 28.82,8.28 27.9,7.36 R67.1
  Top 0.406: U8.K12 v35.11,12.11
  Route3 0.102: v35.11,12.11 34.7,11.7 34.7,10.8 33.45,9.55 v33.04,9.55
FPGA_LED3  (via drill 0.2)
  Top 0.102: v33.04,10.06 31.46,8.48 27.72,8.48 26.6,7.36 R69.1
  Top 0.406: U8.J11 v36.11,13.11
  Route3 0.102: v36.11,13.11 35.46,12.46 34.97,12.46 34.5,11.99 34.5,10.9 33.66,10.06 v33.04,10.06
FPGA_M0  (via drill 0.2)
  Top 0.102: R55.2 v38.56,5.51
  Top 0.406: U8.M7 v33.11,17.89
  Route2 0.102: v33.11,17.89 32.48,17.26 32.48,8.48 35.32,5.64 38.43,5.64 v38.56,5.51
FPGA_M1  (via drill 0.2)
  Top 0.102: R54.2 39.9,5.22 v39.26,5.86
  Top 0.406: U8.M8 v33.11,16.11
  Route2 0.102: v33.11,16.11 32.68,15.68 32.68,13.44 33.6,12.52 33.6,7.7 35.44,5.86 v39.26,5.86
FPGA_M2  (via drill 0.2)
  Top 0.102: R52.2 38.13,7.29 37.96,7.12 v37.96,7.06
  Top 0.406: U8.M9 v33.11,15.11
  Route2 0.102: v33.11,15.11 33.76,14.46 34.26,14.46 34.56,14.16 34.56,7.05 35.54,6.06 37.64,6.06 37.96,6.38 v37.96,7.06
  Route3 0.127: J5.3 38.65,2.45 37.96,3.14 v37.96,7.06
FPGA_VCC_1V  (via drill 0.2, 0.3)
  Top 0.102: R21.1 v24.39,31.71
  Top 0.406: U8.D6 v41.89,18.89 | U8.D8 v41.89,16.11 | U8.E7 v40.89,17.89 | U8.E9 v40.89,15.11 | U8.F6 v39.89,18.89 | U8.G9 v38.89,15.11 | U8.H6 v37.11,18.89 | U8.J9 v36.11,15.11 | U8.K6 v35.11,18.89 | U8.K8 v35.11,16.11 | U8.E5 v40.89,19.89 | U8.G5 v38.89,19.89 | U8.J5 v36.11,19.89
  Top 0.508: v29.01,19.81 28.64,20.18 v28.64,21.36 | v30.32,17.02 30.22,17.02 26.8,20.44 C65.2 C64.2 C63.2 C62.2 C66.2 26.82,25.78 C67.2 | 26.83,26.93 C60.2 C61.2 26.83,31.44 C59.2 27.2,31.23 v27.66,31.23 v27.66,30.66 v27.65,30.65
  Top 0.61: 26.83,26.93 C67.2
  Top 0.813: C59.2 26.43,32 26.01,32 25.41,31.4 R21.1
  Route3 0.305: v41.89,16.11 41,17 | v41.89,18.89 v40.89,17.89 40,17 39.8,17 | v39.89,18.89 38,17 | v37.11,18.89 36.62,18.4 35.6,18.4 | v35.11,18.89 35.6,18.4 | 35.6,18.4 34.8,18.4 34.56,18.16 34.56,17.7 33.9,17.04 33.9,17.02 33.9,17 34.22,17 v35.11,16.11 v36.11,15.11 | v40.89,15.11 40.38,14.6 39.4,14.6 v38.89,15.11 37,17 36.8,17
  Route3 0.61: v30.32,17.02 33.9,17.02 | 33.9,17 36.8,17 38,17 39.8,17 41,17
  Bottom 0.102: U5.7 20.02,32.09 20.25,32.31 20.25,32.85 20.83,33.43 22.71,33.43 23.68,32.46 23.86,32.46 24.1,32.23 24.1,31.98 24.37,31.71 v24.39,31.71
  Bottom 0.305: 35.62,20.36 v36.1,19.88 v36.11,19.89 | 35.62,20.36 35.6,20.38 38.46,20.38 | 35.62,20.36 30.61,20.36 30.06,19.81 v29.01,19.81 | 38.46,20.38 38.89,19.95 v38.89,19.89 | 38.46,20.38 38.45,20.39 40.39,20.39 v40.89,19.89
  Bottom 0.508: v28.64,21.36 28.6,21.36 C72.2 C73.2 C71.2 C70.2 28.35,27.05 C69.2 28.25,28.35 27.65,28.95 v27.65,30.65 v27.66,30.66 v27.66,31.23
FPGA_VCC_1V8  (via drill 0.2, 0.3, 0.45)
  Top 0.102: R47.2 47.4,15.55 v46.76,16.19 | R18.1 24.26,26.16 24.26,26.14 24.11,25.99 24.11,25.57 23.74,25.21 20.73,25.21 20.25,25.69 20.25,26.75 v20.02,26.98
  Top 0.406: U8.F10 v39.89,14.11 | U8.H10 v37.11,14.11 | U8.K10 v35.11,14.11 | U8.L9 v34.11,15.11
  Top 0.61: v25.2,27.1 R18.1 | v48.62,16.26 48.6,16.28 48.6,17.86 47.3,19.16 47.3,27.16 46.16,28.3 36.75,28.3 36.25,28.8 36.25,29.84 35.69,30.4 C56.2 C55.2 34.05,30.39 C54.2 31.48,30.39 31.02,29.93 C53.2 30.2,29.55 v30.2,29.09 v30.2,28.39
  Route3 0.61: R18.1 v25.2,27.1 28.91,27.1 v30.2,28.39 v30.2,29.09
  Bottom 0.102: U5.14 v20.02,26.98
  Bottom 0.2: v39.89,14.11 39.36,14.64 39.36,15.54 38.85,16.05
  Bottom 0.305: v37.11,14.11 36.6,13.6 35.62,13.6 v35.11,14.11 | 37.97,15.63 34.62,15.63 34.11,15.12 v34.11,15.11
  Bottom 0.61: v37.11,14.11 37.97,14.97 37.97,15.63 38.43,15.63 38.85,16.05 R48.2 38.9,16.34 39.69,17.13 45.43,17.13 46.37,16.19 v46.76,16.19 C57.2 48.58,16.2 C58.2 48.6,16.24 v48.62,16.26
  other vias: 47.4,14 24.7,26.6
FPGA_VCC_SRAM_MON  (via drill 0.2, 0.3, 0.4)
  Top 0.508: M2.3 45.55,30.79 45.55,31.41 M2.2
  Top 0.61: v25.25,30.19 24.86,29.8 R28.1 | v44.75,32.09 M2.1 M2.2 v44.75,31.43
  Route3 0.102: R28.1 23.95,30.55 22.36,30.55 v22.33,30.58
  Route3 0.61: v25.25,30.19 24.86,29.8 R28.1 | 44.09,32.09 v44.75,32.09 v44.75,31.43 44.09,32.09 | 44.09,32.09 27.15,32.09 v25.25,30.19 | v25.25,30.19
  Bottom 0.102: U5.9 v22.32,30.57 v22.33,30.58
  other vias: 24.7,29.8
FPGA_VCCIO_MON  (via drill 0.2, 0.3, 0.4)
  Top 0.61: v25.2,28.65 25.15,28.65 R17.1 | 37.99,31.26 38.61,31.88 39.35,31.88 M1.1 M1.2 M1.3 39.15,31.19 v38.62,31.19 38.06,31.19 37.99,31.26 | 37.99,31.26 v37.99,31.19
  Route3 0.102: v22.33,28.63 22.35,28.65 24.25,28.65 R17.1
  Route3 0.61: R17.1 25.9,29.4 27.72,29.4 28.67,30.35 37.14,30.35 v37.98,31.19 v37.99,31.19 v38.62,31.19
  Bottom 0.102: U5.12 v22.32,28.62 v22.33,28.63
  other vias: 24.7,28.2
GCLK_32  (via drill 0.2)
  Top 0.102: X2.3 v35.2,7.5
  Top 0.406: U8.G11 v38.89,13.11
  Route3 0.102: v35.2,7.5 35.2,9 36.71,10.51 36.71,12.31 36.96,12.56 38.69,12.56 38.89,12.76 v38.89,13.11
GCLK_100  (via drill 0.2)
  Top 0.102: v31.9,7.5 X3.3
  Top 0.152: U8.A10 v45.1,14.5
  Top 0.406: U8.H11 v37.11,13.11
  Route3 0.102: v37.11,13.11 36.5,12.5 36.5,10.7 34.2,8.4 32.8,8.4 v31.9,7.5
  Bottom 0.102: v45.1,14.5 45.06,14.46 41.74,14.46 40.78,13.5 U8.H11 v37.11,13.11
GND  (via drill 0.2, 0.3, 0.5)  (282 unrouted)
  Top 0.102: U7.19 v26.12,16 | v8.54,29.66 U2.11 8.06,29.6 v8,29.66
  Top 0.127: v42.89,16.11 U8.B9 43.11,15.11 v42.89,15.11
  Top 0.2: U9.9 51,10.4 49.8,10.4
  Top 0.254: U10.D1 v53.79,22.31 | U10.E6 v49.41,23.69
  Top 0.305: R12.2 9.67,29.1 | 9.67,29.1 9.07,29.1 | U2.5 9.6,29.03 9.67,29.1
  Top 0.406: U8.A14 v44.89,10.11 | U8.A6 v44.89,18.89 | U8.B4 v43.89,20.89 | U8.B7 v43.89,17.89 | U8.C13 v42.89,11.11 | U8.C6 v42.89,18.89 | U8.C7 v42.89,17.89 | U8.C8 v42.89,16.11 | U8.C9 v42.89,15.11 | U8.D5 v41.89,19.89 | U8.D7 v41.89,17.89 | U8.D9 v41.89,15.11 | U8.E1 v40.89,23.89 | U8.E10 v40.89,14.11 | U8.E14 v40.89,10.11 | U8.E3 v40.89,21.89 | U8.E6 v40.89,18.89 | U8.E8 v40.89,16.11 | U8.F5 v39.89,19.89 | U8.F9 v39.89,15.11 | U8.G10 v38.89,14.11 | U8.G12 v38.89,12.11 | U8.G3 v38.89,21.89 | U8.G6 v38.89,18.89 | U8.H5 v37.11,19.89 | U8.H9 v37.11,15.11 | U8.J10 v36.11,14.11 | U8.J6 v36.11,18.89 | U8.J7 v36.11,17.89 | U8.J8 v36.11,16.11 | U8.K1 v35.11,23.89 | U8.K14 v35.11,10.11 | U8.K5 v35.11,19.89 | U8.K7 v35.11,17.89 | U8.K9 v35.11,15.11 | U8.L10 v34.11,14.11 | U8.L11 v34.11,13.11 | U8.L4 v34.11,20.89 | U8.L6 v34.11,18.89 | U8.L8 v34.11,16.11 | U8.N12 v32.11,12.11 | U8.N3 v32.11,21.89 | U8.N5 v32.11,19.89 | U8.N9 v32.11,15.11 | U8.P1 v31.11,23.89 | U8.P14 v31.11,10.11 | U8.C2 v42.89,22.89 | U8.A1 v44.89,23.89 | U8.A9 v45.1,15.5 | U8.D11 v41.88,13.12 | U8.A11 v45.1,13.5 | C30.2 v14,11.4 | R5.2 v13.52,31.4 | C24.2 v14.9,16.8
  Bottom 0.102: R30.1 | U3.10 6.11,22.65 v5.9,22.65 | U3.21 v7,25 | U3.21 v7,24.2 | U3.21 v7.8,25 | U3.21 v7.8,24.2 | C13.2 v16.01,31.09 v16.02,31.1
  Bottom 0.406: C75.1 27.46,12.37 | C70.1 26.81,25.4 | C68.2 v54.6,9.6 | C18.1 v19.4,19.2 | C16.2 v14,4.1 | C32.2 v20.28,19.38 | C34.1 v53.1,3.73 | C26.1 v22.58,19.38 | C35.1 v51.1,3.73 | C58.1 v48.6,14.62 | R31.1 v14,31.91 | C15.2 14.11,2.7 v14.09,2.72
  Bottom 0.508: C5.2 v3.55,27.35
  other vias: 1,1 45.95,25.01 19.6,4.4 17.2,7.9 2.1,28.85 22,17.6 22,16.4 21.4,17 22.6,17 22,17 20.8,17 23.2,17 22,15.8 22,18.2 23,22.5 10.4,29.1 25.18,20.09 46.8,15.5 46.8,14.9 45.7,15.5 46.3,13.1 46.3,12.5 47.6,10.4 46.6,9 46.6,8.5 46.6,8 46.6,9.5 47.1,9.5 46.6,7.5 47.1,7.5 47.6,7.5 45,9 43,9 42,9 41,9 39,9 38,8 31,9 30,10 27,9 26,9 28,9 23,12 20,9 36,8 36,9 42,5 49,1 50,1 51,1 52,1 53,1 54,1 57,1 57,4 55,5 56,5 57,5 57,6 56,8 56,11 56,12 56,13 56,14 56,16 55,16 18.1,21.7 15,23 14,23 8,21 8,20 9,20 9,21 10,21 10,20 11,21 9,16 1,11 1,9 1,7 1,5 19.7,29.6 51.6,11 51,33 52,33 53,33 54,33 57,33 57,30 56,29 57,29 57,28 53,32 15.6,29.4 8,14 8,12 8,10 8,8 10,8 10,10 10,12 10,14 10,16 12,16 12,14 12,12 12,10 7,33 5,33
  pour Bottom (rank 2, hatched): 57.5,0.3 0.3,0.3 0.3,33.7 57.5,33.7
  pour Route2: 0.3,0.3 0.3,33.7 57.5,33.7 57.5,0.3
  pour Route3: 0.3,33.7 0.3,0.3 57.5,0.3 57.5,33.7
  pour Top (hatched): 0.3,0.3 57.5,0.3 57.5,33.7 0.3,33.7
JTAG_TCK  (via drill 0.2)
  Top 0.406: U8.A7 v44.89,17.89
  Bottom 0.102: v44.89,17.89 55.04,17.89 56.63,19.48 56.63,27.79 52.58,31.84 46.69,31.84 J2.3
JTAG_TDI  (via drill 0.2)
  Top 0.406: U8.P7 v31.11,17.89
  Bottom 0.102: v31.11,17.89 31.11,18.08 31.3,18.27 55.13,18.27 56.43,19.56 56.43,27.71 53.18,30.96 43.75,30.96 42.98,31.73 J2.5
JTAG_TDO  (via drill 0.2)
  Top 0.102: J2.4 44.26,32.98 43.71,32.44 43.71,30.59 44.04,30.26 v44.41,30.26
  Top 0.406: U8.P6 v31.11,18.89
  Bottom 0.102: v31.11,18.89 31.55,19.33 55.56,19.33 56.01,19.78 56.01,27.55 53.3,30.26 v44.41,30.26
JTAG_TMS  (via drill 0.2)
  Top 0.406: U8.M6 v33.11,18.89
  Bottom 0.102: v33.11,18.89 U8.M6 55.02,18.5 56.21,19.69 56.21,27.63 53.1,30.74 43.56,30.74 41.72,32.59 J2.6
MCU_1V1  (via drill 0.2)
  Top 0.152: U7.23 v24.78,17.6
  Top 0.2: C25.1 16.54,18.8 U7.45
  Top 0.254: C25.1 v16.51,19.47 | U7.50 C24.1
  Bottom 0.2: v16.51,19.47 16.5,19.46 C24.1 | C26.2 24.78,18.78 v24.78,17.6
  Bottom 0.254: v16.51,19.47 16.51,19.55 17.3,20.34 23.84,20.34 24.18,20 C26.2
  other vias: 16.5,16.8
MCU_QSPI_SCLK
  Top 0.102: U6.6 13.18,13.72 12.8,14.1 12.8,15.37 13.44,16 U7.52
MCU_QSPI_SD0
  Top 0.102: U7.53 17.51,15.6 17.32,15.79 13.51,15.79 13,15.28 13,14.49 13.27,14.22 U6.5
MCU_QSPI_SD1
  Top 0.102: U7.55 17.7,14.8 17.5,14.6 17.5,14.1 16.62,13.22 U6.2
MCU_QSPI_SD2
  Top 0.102: U7.54 17.4,15.2 17.2,15 17.2,14.3 16.62,13.72 U6.3
MCU_QSPI_SD3
  Top 0.102: U6.7 13.38,13.22 12.6,14 12.6,15.47 13.33,16.2 17.3,16.2 17.5,16.4 U7.51
MCU_QSPI_SS  (via drill 0.2)
  Top 0.102: U7.56 18,14.4 17.8,14.2 17.8,13.9 17.2,13.3 17.2,12.72 | U6.1 17.2,12.72 | 17.2,12.72 R45.2
  Bottom 0.127: R44.1 R45.2
  other vias: 17.2,12.7
MCU_USB_D_N
  Top 0.127: U7.46 17.96,18.4 17.87,18.31 17.09,18.31 16.39,17.61 10.09,17.61 R43.1
MCU_USB_D_P
  Top 0.127: U7.47 17.97,18 17.88,18.09 17.29,18.09 16.59,17.39 10.09,17.39 R42.1
N$1
  Top 0.127: R7.P$2 8.6,31.85 U2.8
N$2
  Top 0.127: U2.6 9.6,31.8 9.9,32.1 11.22,32.1 R5.1
N$3
  Top 0.102: R4.1 8.32,26.1 6.47,27.95 2.78,27.95 2.54,27.71 2.54,26.87 Q1.1
N$4
  Bottom 0.254: U3.1 10.4,25.39 10.88,25.87 L2.1
N$5
  Bottom 0.254: U3.18 7.4,28 L1.1
N$6
  Top 0.127: U2.3 8.61,28.16 8.61,27.43 8.91,27.13 10.68,27.13 11.05,27.5 11.05,29.65 11.45,30.05 D2.2
N$7
  Top 0.2: D2.1 12.92,30.04 R6.2
N$8  (via drill 0.2)
  Route2 0.152: v7.78,22.4 6.7,22.4 6.1,23 6.1,29.6 v5.9,29.8
  Bottom 0.102: R8.2 8.06,31.4 C7.2 R9.1
  Bottom 0.152: U3.7 7.81,22.43 v7.78,22.4 | v5.9,29.8 5.9,31.1 6.2,31.4 R9.1 8.06,31.4 | C7.2 R8.2
N$9
  Bottom 0.254: U3.15 3.65,25.39 L3.2
N$10  (via drill 0.2)
  Top 0.102: R47.1 46.9,13.5 46.9,13.52 46.14,14.29 46.14,15.62 45.72,16.04 43.96,16.04 43.89,16.11
  Top 0.406: 43.89,16.11 U8.B8
  other vias: 47.4,13
N$11  (via drill 0.2)
  Top 0.102: v7.4,22.02 6.9,22.02 6.8,22.12 5.22,22.12 v4.83,22.51
  Bottom 0.102: R14.2 C11.2 R15.1 v4.83,22.51 | U3.8 v7.4,22.02
N$12  (via drill 0.2)
  Route2 0.152: v8.3,22.4 9.05,22.4 9.44,22.79 9.44,27.77 9.79,28.12 v10.39,28.12
  Bottom 0.102: R12.1 v10.39,28.12
  Bottom 0.15: R11.2 C9.2 11.35,29.1 11.05,28.8 11.05,28.33 10.82,28.1 R12.1
  Bottom 0.152: U3.6 8.19,22.51 v8.3,22.4
N$13
  Bottom 0.102: R27.2 13,7.1 13.2,7.3 15.4,7.3 15.6,7.1 R24.2 16,6.7 16.3,6.4 16.3,3.8 16.68,3.42 U4.1
N$14  (via drill 0.2)
  Top 0.406: U8.N7 v32.11,17.89
  Bottom 0.102: v32.11,17.89 31.74,17.89 31.29,17.44 30.79,17.44 29.99,18.24 27.4,18.24 27,17.84 27,15.24 R49.1
N$15  (via drill 0.2)
  Top 0.102: U7.21 24.84,16.8 v24.78,16.86
  Bottom 0.102: R46.1 24.54,17.1 v24.78,16.86
N$16  (via drill 0.2)
  Top 0.406: U8.F8 v39.89,16.11
  Bottom 0.406: R48.1 v39.89,16.11
N$17
  Bottom 0.102: R46.2 22.95,18.1 X1.3 21.88,19.07 C32.1
N$19  (via drill 0.2)
  Top 0.102: J4.B5 7.35,15.25 v7.8,15.7
  Bottom 0.102: R2.2 v7.8,15.7
N$20  (via drill 0.2)
  Top 0.102: U7.20 24.82,16.4 v24.78,16.36
  Bottom 0.102: v24.78,16.36 24.78,15.88 23.7,14.8 22.05,14.8 X1.1 20.85,15.5 C31.1
N$21  (via drill 0.2)
  Top 0.102: R29.2 15,24.9 14.7,25.2 14.7,26.3 15.1,26.7 15.4,26.7 15.6,26.9 R25.2
  Bottom 0.102: U5.1 16.8,28.62 16.6,28.82 15.82,28.82 15.6,28.6 R25.2
  other vias: 15.6,28.2
N$23  (via drill 0.2)
  Route2 0.102: v12.3,22.55 v12.29,22.54 10.28,22.54 v9.94,22.88
  Bottom 0.102: U3.4 9.38,24.2 9.94,23.63 v9.94,22.88 | R10.1 v12.3,22.55
  Bottom 0.2: R10.1 12.28,22.49 12.28,22.16 12.54,21.9 13.13,21.9 13.33,21.7 R13.2
N$31
  Top 0.102: R63.2 D6.1
N$32
  Bottom 0.102: R22.2 16.1,4.9 16.1,3.55 16.7,2.95 16.7,2.2 17.4,1.5 18.4,1.5 18.62,1.73 U4.16
N$34
  Bottom 0.102: R30.2 18.9,7.9 19.27,7.53 U4.6
N$35  (via drill 0.2)
  Top 0.102: J4.A5 6.3,18.3 v7.8,18.3
  Bottom 0.102: R1.1 v7.8,18.3
N$42
  Top 0.102: R64.2 D7.1
N$48
  Bottom 0.2: U5.16 18.73,27 18.53,26.81 15.79,26.81 R23.2
N$50
  Bottom 0.102: R31.2 15.6,32.29 16.09,32.78 18.96,32.78 19.38,32.36 U5.6
N$61
  Top 0.102: R67.2 D8.1
N$62
  Top 0.102: R69.2 D9.1
N$70
  Top 0.102: R36.2 D3.1
N$71
  Top 0.102: D4.1 R38.2
N$72
  Top 0.102: R40.2 D5.1
PGOOD  (via drill 0.2)
  Top 0.102: v10.5,22.89 10.5,20.55 11.5,19.55 TP2.1
  Bottom 0.102: U3.3 9.71,24.6 10.5,23.81 v10.5,22.89
  other vias: 11.5,19.5
PIO0/SPI2FLASH_MISO(SPI0)  (via drill 0.2)
  Top 0.102: v52.2,15.6 52.63,16.03 54.31,16.03 55.33,15 55.33,7.53 51.95,4.14 50.04,4.14 v49.3,3.4 | U7.2 19.8,12.5 20.66,11.64 20.66,1.36 21.75,0.27 28.29,0.27 J1.16
  Top 0.2: U9.2 52.23,15.56 v52.2,15.6
  Route2 0.102: v49.3,3.4 47.73,1.78 29.8,1.78 J1.16
  Bottom 0.102: R66.2 49.8,15.2 50.55,15.95 51.85,15.95 v52.2,15.6
  Bottom 0.2: R57.2 52.8,14.6 52.8,15.3 52.5,15.6 v52.2,15.6
PIO1/SPI2FLASH_CS(SPI0)  (via drill 0.2)
  Top 0.102: v53.5,15.6 53.64,15.74 54.27,15.74 55.13,14.88 55.13,7.61 51.89,4.37 49.77,4.37 48.87,3.47 v48.87,1.82 | U7.3 20.2,12.41 20.86,11.76 20.86,2.14 v21.3,1.7
  Top 0.2: U9.1 v53.51,15.6 v53.5,15.6
  Top 0.406: U8.C11 v42.89,13.11
  Route2 0.102: v48.87,1.82 48.62,1.57 30.86,1.57 J1.15
  Bottom 0.102: v53.5,15.6 52.9,16.2 50.5,16.2 49.1,14.8 49.1,14.6 48,13.5 45.9,13.5 45.4,13 45.2,13 44.8,12.6 43.4,12.6 v42.89,13.11 | J1.15 30.29,0.99 29.57,0.27 22.27,0.27 21.3,1.24 v21.3,1.7
  Bottom 0.2: R59.2 54.2,14.4 54.2,15.4 54,15.6 v53.5,15.6
PIO2/SPI2FLASH_SCK(SPI0)  (via drill 0.2)
  Top 0.102: v45.1,16.5 45.54,16.5 46.35,15.69 46.35,14.46 47.2,13.61 47.69,13.61 48.6,12.7 R61.1 | U7.4 20.6,12.3 21.06,11.84 21.06,2.44 v21.8,1.7
  Top 0.2: U9.6 51,7.07 v51,6.8
  Top 0.406: U8.A8 v45.1,16.5
  Route2 0.102: v51,6.8 51,7 50.6,7.4 49.2,7.4 R61.1 48.6,5.46 45.32,2.18 27.66,2.18 J1.18
  Bottom 0.102: J1.18 25.95,0.47 22.44,0.47 21.8,1.11 v21.8,1.7
  Bottom 0.2: R60.2 v51,6.8
  other vias: 48.6,8
PIO3/SPI2FLASH_MOSI(SPI0)  (via drill 0.2)
  Top 0.102: U7.5 21,12.2 21.27,11.93 21.27,2.81 22.3,1.78 22.3,1.24 23.07,0.47 27.22,0.47 J1.17 | v49.7,6.8 49.7,4.92 48.43,3.65 v48.4,3.39
  Top 0.2: U9.5 v49.7,6.8
  Route2 0.102: J1.17 28.73,1.98 47.02,1.98 v48.4,3.39
  Bottom 0.102: R65.2 R58.2
  Bottom 0.2: R58.2 50.9,8 v49.7,6.8
PIO4/UART1_TX  (via drill 0.2)
  Top 0.102: v21.78,10.22 21.6,10.4 21.6,12.29 21.4,12.48 U7.6
  Bottom 0.102: v21.78,10.22 21.92,10.22 22.61,9.54 26.06,9.54 26.36,9.24 26.36,2.42 27.25,1.53 31.02,1.53 J1.14
PIO5/UART1_RX  (via drill 0.2)
  Top 0.102: v22.3,10.34 22.26,10.34 21.8,10.8 U7.7
  Bottom 0.102: v22.3,10.34 22.89,9.75 26.14,9.75 26.56,9.32 26.56,2.5 27.33,1.73 32.1,1.73 J1.13
PIO6/I2C1_SDA  (via drill 0.2)
  Top 0.102: v22.18,10.92 22.24,10.98 22.2,11.02 U7.8 | v20.1,10.92 19.96,10.78 16.86,10.78 16.37,10.29 16.38,7.42 v16.6,7.2 | v18.72,32.23 19,31.95 19,26.75 19.29,26.45 19.29,24.52 19.64,24.18 v19.64,24.12
  Route2 0.102: v19.64,24.12 20.12,24.6 26.5,24.6 26.99,25.09 26.99,25.71 29,27.72 v29,28.7
  Bottom 0.102: U5.5 v18.73,32.23 | U4.5 18.62,7.04 18.46,7.2 v16.6,7.2 | v20.1,10.92 v22.18,10.92 26.15,10.92 26.8,11.56 26.8,22.12 25.53,23.39 20.67,23.39 20.5,23.56 20.5,23.58 20.2,23.88 19.88,23.88 v19.64,24.12 19.64,24.17 18.95,24.86 R35.2 | v20.1,10.92 | J2.16 29,30.14 v29,28.7
  Bottom 0.2: v18.73,32.23 v18.72,32.23
PIO7/I2C1_SCL  (via drill 0.2)
  Top 0.102: v19.46,11.3 17.09,11.3 16.14,10.34 16.14,7.06 16.5,6.7 v16.6,6.7 | v18.19,32.23 18.76,31.66 v18.76,26.33 18.76,24.42 19.04,24.14 v19.14,24.14 | U7.9 22.6,11.46 v22.78,11.28
  Route2 0.102: v29.4,29.1 28.8,29.1 28.6,28.9 28.6,27.6 26.79,25.79 26.79,25.18 26.42,24.8 19.8,24.8 v19.14,24.14
  Bottom 0.102: U5.4 17.14,30.57 16.94,30.77 16.94,31.9 17.27,32.23 v18.19,32.23 | U4.4 16.82,5.38 16.6,5.6 v16.6,6.7 | v18.76,26.33 18.82,26.33 R32.2 | v19.14,24.14 19.14,23.94 19.4,23.68 20.1,23.68 20.59,23.19 25.42,23.19 26.59,22.02 26.59,11.65 26.22,11.28 v22.78,11.28 22.76,11.3 v19.46,11.3 | v29.4,29.1 29.42,29.12 29.42,32.13 J2.15
PIO8/SPI_MISO(SPI1)/I2C0_SDA  (via drill 0.2)
  Top 0.102: v26.06,11.66 24.72,11.66 23.4,12.98 U7.11
  Route2 0.102: v26.06,11.66 26.21,11.81 26.23,11.81 27.8,13.38 27.8,25.33 28.87,26.4 31.13,26.4 34.24,29.51 35.29,29.51 v35.5,29.7
  Bottom 0.102: v35.5,29.7 35.5,32.87 J2.11
PIO9/SPI_NSS(SPI1)/I2C0_SCL  (via drill 0.2)
  Top 0.102: v26.08,12.16 24.62,12.16 23.8,12.98 U7.12
  Route2 0.102: v26.08,12.16 27.6,13.68 27.6,25.41 28.78,26.6 31.04,26.6 33.8,29.36 v33.8,29.7
  Bottom 0.102: v33.8,29.7 33.8,32.7 J2.12
PIO10/SPI_SCK(SPI1)/I2C1SDA  (via drill 0.2)
  Top 0.102: v26.08,12.66 25.86,12.66 25.72,12.52 24.66,12.52 24.2,12.98 U7.13
  Route2 0.102: v26.08,12.66 27.39,13.97 27.39,25.54 28.66,26.8 30.96,26.8 32.8,28.64 v32.8,29.7
  Bottom 0.102: v32.8,29.7 32.8,32.98 J2.13
PIO11/SPI_MOSI/I2C1SCL  (via drill 0.2)
  Top 0.102: v26.08,13.16 25.88,13.16 25.46,12.74 24.84,12.74 24.6,12.98 U7.14
  Route2 0.102: v26.08,13.16 27.19,14.27 27.19,25.62 28.57,27 30.88,27 32.4,28.53 32.4,29.12 31.82,29.7 v31.8,29.7
  Bottom 0.102: v31.8,29.7 31.55,29.95 J2.14
PIO12/!FPGA_RESET  (via drill 0.2)
  Top 0.102: v18.1,6.3 18.07,6.28 S3.2 S3.1 | U7.15 26.3,14.4 27.95,12.75 v27.95,11.78 27.95,11.73 27.48,11.26 R62.1
  Top 0.406: U8.L7 v34.11,17.89
  Route2 0.102: v18.1,6.3 18.1,9.34 18.46,9.7 25.87,9.7 v27.95,11.78 28.36,11.78 v30.58,14
  Bottom 0.102: v34.11,17.89 33.61,17.89 32.31,16.59 30.84,16.59 30.58,16.33 v30.58,14
PIO13/GPIO2FPGA_0  (via drill 0.2)
  Top 0.102: v30.3,11 30.09,11 26.29,14.8 U7.16
  Top 0.406: U8.M13 v33.11,11.11
  Route3 0.102: v33.11,11.11 32.7,10.7 30.6,10.7 v30.3,11
PIO14/GPIO2FPGA_1
  Top 0.102: 31.12,11.5 29.9,11.5 26.2,15.2 U7.17
  Top 0.406: 31.12,11.5 U8.P13
PIO15/GPIO2FPGA_2  (via drill 0.2)
  Top 0.102: v30.3,11.9 29.8,11.9 26.1,15.6 U7.18
  Top 0.406: U8.L12 v34.11,12.11
  Route3 0.102: v34.11,12.11 33.55,11.55 30.65,11.55 v30.3,11.9
PIO16/SPI2FPGA_MISO  (via drill 0.2)
  Top 0.102: U7.27 26.29,19.2 27.88,17.61 27.88,14.13 29.61,12.4 v30.3,12.4
  Top 0.406: U8.M12 v33.11,12.11
  Route3 0.102: v33.11,12.11 32.75,11.75 30.95,11.75 v30.3,12.4
PIO17/SPI2FPGA_CS
  Top 0.102: 31.12,12.5 30.7,12.5 30.45,12.75 29.55,12.75 28.09,14.21 28.09,17.68 26.17,19.6 U7.28
  Top 0.406: U8.P12 31.12,12.5
PIO18/SPI2FPGA_SCK
  Top 0.102: U7.29 25.62,20.44 28.29,17.77 28.29,14.31 29.6,13 32,13 32.11,13.11
  Top 0.406: U8.N11 32.11,13.11
PIO19/SPI2FPGA_MOSI
  Top 0.102: 31.12,13.5 29.4,13.5 28.5,14.39 28.5,17.85 25.16,21.2 24.4,21.2 24.2,21 U7.30
  Top 0.406: 31.12,13.5 U8.P11
PIO20/GPIO2FPGA_3
  Top 0.102: 31.12,14.5 29.52,14.5 28.71,15.31 28.71,17.95 25.26,21.4 24.2,21.4 23.8,21 U7.31
  Top 0.406: 31.12,14.5 U8.P10
PIO21/!PWR_FPGA_IO_SRAM  (via drill 0.2)
  Top 0.102: U7.32 23.4,21.84 23.84,22.28 | 23.84,22.28 25.2,22.28 25.54,22.62 v25.54,25.31 | R33.2 24.08,22.52 23.84,22.28 | M1.4 39.58,30.09 v39.58,29.68
  Route2 0.102: v25.54,25.31 25.54,25.79 26.06,26.31 26.06,31.16 26.97,32.08 38.71,32.08 39.58,31.21 v39.58,29.68
PIO22/LED0  (via drill 0.2)
  Top 0.102: v18.1,24.1 18.1,27.1 18.12,27.12 R36.1 | U7.34 22.6,22.64 v22.4,22.84
  Bottom 0.102: v18.1,24.1 18.1,23.8 18.44,23.46 20.03,23.46 20.58,22.91 22.33,22.91 v22.4,22.84
PIO23/PWR_ON_1V8_1V  (via drill 0.2)
  Top 0.102: v22.2,22.05 U7.35 | v11.5,21.76 14.41,21.76 v15.66,23
  Route2 0.102: v5.09,24.39 5.09,22.85 5.82,22.12 6.68,22.12 7.25,21.55 11.29,21.55 v11.5,21.76
  Route3 0.102: v22.2,22.05 22.2,22.55 21.74,23 v15.66,23
  Bottom 0.102: U3.13 5.3,24.6 v5.1,24.4 | v5.1,24.4 v5.09,24.39 | U3.12 5.3,24.19 v5.1,24.4
PIO24/LED1  (via drill 0.2)
  Top 0.102: U7.36 v21.8,22.34 | R38.1 16.32,26.88 17.1,26.1 v17.1,24.1
  Bottom 0.102: v17.1,24.1 17.1,23.8 17.64,23.26 19.91,23.26 20.62,22.55 21.6,22.55 v21.8,22.34
PIO25/LED2  (via drill 0.2)
  Top 0.102: U7.37 v21.4,22.02 | v16,24.1 14.8,24.1 14.42,24.48 14.42,27.5 R40.1
  Bottom 0.102: v21.4,22.02 21.1,22.32 20.48,22.32 19.76,23.05 17.04,23.05 16,24.08 v16,24.1
PIO26/ADC0  (via drill 0.2)
  Top 0.102: U7.38 21,23.9 v21.2,24.1
  Route3 0.102: v21.2,24.1 21.2,30.22 22.88,31.9 22.88,32.5 23.38,33 J2.20
PIO27/ADC1  (via drill 0.2)
  Top 0.102: U7.39 v20.6,24.1
  Bottom 0.102: v20.6,24.1 v20.6,24.11 23.1,26.61 23.1,29.66 25.2,31.77 J2.19
PIO28/ADC2/UART0_TX  (via drill 0.2)
  Top 0.102: R29.1 16.4,24 17.1,23.3 19.7,23.3 20.2,22.8 | 20.2,22.8 U7.40 | 20.2,22.8 20.2,24.4 20.45,24.65 21.55,24.65 21.8,24.4 v21.8,24.1
  Bottom 0.102: v21.8,24.1 21.8,24.94 23.31,26.45 23.31,29.58 26.48,32.75 J2.18
  other vias: 16.4,24.9
PIO29/ADC3/UART0_RX  (via drill 0.2)
  Top 0.102: U7.41 19.8,21.72 19.37,22.15 v18.5,22.15
  Route2 0.102: v13.1,18.3 13.1,19.5 15.75,22.15 v18.5,22.15 20.46,22.15 v22.4,24.09 v22.4,24.1
  Bottom 0.102: v13.1,18.3 13.1,8.79 12,7.69 R27.1 | v22.4,24.1 22.4,25.25 23.51,26.36 23.51,29.5 26.13,32.12 27.02,32.12 27.75,32.84 J2.17
PUDC_B  (via drill 0.2)
  Top 0.102: U8.B10 44,15 45.14,15 46.7,13.44 46.7,12.07 47,11.77 v47,11.68
  Bottom 0.102: R51.1 v47,11.68
RAW_VCC  (via drill 0.2)
  Top 0.102: v6,2.5 5.95,2.5 3.41,5.04 3.41,23.51 3.6,23.7 3.6,24.1 R19.2 4.05,24.55
  Top 0.508: D1.1 6.2,25.01 6.2,26.4 5.74,26.86 Q1.2
  Top 0.61: Q1.2 4.45,25.65 4.05,25.25 4.05,24.55
  Bottom 0.102: U4.13 20.57,1.88 20.4,1.7 20.4,1.23 19.77,0.6 7.8,0.6 6,2.4 v6,2.5
SPI2FLASH_DQ2  (via drill 0.2)
  Top 0.2: U9.3 50.97,15.56 v51,15.6
  Bottom 0.102: R68.2 R56.2
  Bottom 0.2: R56.2 52,14 51.5,14.5 51.5,15.3 51.2,15.6 v51,15.6
SPI2FLASH_DQ3  (via drill 0.2)
  Top 0.2: U9.7 52.25,7.09 v52.25,6.8
  Route2 0.102: v48.1,10 48.1,9.2 49.3,8 51.5,8 52.25,7.25 v52.25,6.8
  Bottom 0.102: R70.2 48.2,10 v48.1,10
  Bottom 0.2: R53.2 53.4,7.95 v52.25,6.8
SRAM_A0  (via drill 0.2)
  Top 0.254: U10.A3 v52.29,20.06
  Top 0.406: U8.F1 v39.89,23.89
  Route2 0.1: v52.29,20.06 52.29,19.43 51.56,18.7 47.03,18.7 46.84,18.89 46.84,19.75 46.4,20.19 46.4,20.37 arc-90 46.58,20.55 47.07,20.55 arc90 47.25,20.72 47.25,20.73 arc90 47.07,20.9 45.73,20.9 arc-90 45.55,21.07 45.55,21.08 arc-90 45.73,21.25 47.07,21.25 arc90 47.25,21.43 47.25,21.43 arc90 47.07,21.61 45.73,21.61 arc-90 45.55,21.78 45.55,21.79 arc-90 45.73,21.96 47.07,21.96 arc90 47.25,22.14 47.25,22.14 arc90 47.07,22.32 45.73,22.32 arc-90 45.55,22.49 45.55,22.5 arc-90 45.73,22.67 47.07,22.67 arc90 47.25,22.85 47.25,22.85 arc90 47.07,23.03 45.73,23.03 arc-90 45.55,23.2 45.55,23.21 arc-90 45.73,23.38 47.07,23.38 arc90 47.25,23.56 47.25,23.56 arc90 47.07,23.74 46.58,23.74 arc-90 46.4,23.91 46.4,24.09 46.04,24.45 40.45,24.45 v39.89,23.89
SRAM_A1  (via drill 0.2)
  Top 0.254: U10.A4 v50.91,20.06
  Top 0.406: U8.J3 v36.11,21.89
  Route3 0.1: v50.91,20.06 50.91,19.73 51.02,19.62 55.38,19.62 55.98,19.02 55.98,17.2 55.51,16.73 45.64,16.73 45.34,17.03 45.34,18.97 45.06,19.25 36.92,19.25 36.54,19.63 36.54,21.11 36.34,21.31 36.01,21.31 35.8,21.53 35.8,21.8 35.88,21.89 v36.11,21.89
SRAM_A2  (via drill 0.2)
  Top 0.254: U10.A5 v50.16,20.06
  Top 0.406: U8.G4 v38.89,20.89
  Route3 0.1: v38.89,20.89 39.07,20.89 39.72,20.24 45.32,20.24 45.74,19.82 45.74,17.27 45.88,17.13 51.67,17.13 51.82,17.28 51.82,17.87 52,18.05 52.2,18.05 arc-90 52.37,17.88 52.37,17.44 arc90 52.55,17.27 52.57,17.27 arc90 52.74,17.44 52.74,18.66 arc-90 52.92,18.83 52.94,18.83 arc-90 53.11,18.66 53.11,17.44 arc90 53.28,17.27 53.3,17.27 arc90 53.48,17.44 53.48,18.66 arc-90 53.65,18.83 53.67,18.83 arc-90 53.85,18.66 53.85,17.44 arc90 54.02,17.27 54.04,17.27 arc90 54.22,17.44 54.22,17.88 arc-90 54.39,18.05 54.56,18.05 54.76,18.25 54.76,18.94 54.48,19.22 50.85,19.22 50.16,19.91 v50.16,20.06
SRAM_A3  (via drill 0.2)
  Top 0.254: U10.B3 v52.29,20.81
  Top 0.406: U8.F2 v39.89,22.89
  Route2 0.1: v52.29,20.81 52.29,20.56 51.87,20.14 51.87,19.43 51.34,18.9 48.24,18.9 47.99,19.15 47.99,19.32 arc90 47.81,19.5 47.56,19.5 arc-90 47.38,19.67 47.38,19.68 arc-90 47.56,19.86 48.42,19.86 arc90 48.6,20.03 48.6,20.04 arc90 48.42,20.22 47.56,20.22 arc-90 47.38,20.39 47.38,20.4 arc-90 47.56,20.58 48.42,20.58 arc90 48.6,20.75 48.6,20.76 arc90 48.42,20.94 47.56,20.94 arc-90 47.38,21.11 47.38,21.12 arc-90 47.56,21.3 48.42,21.3 arc90 48.6,21.47 48.6,21.48 arc90 48.42,21.66 47.56,21.66 arc-90 47.38,21.83 47.38,21.84 arc-90 47.56,22.02 48.42,22.02 arc90 48.6,22.19 48.6,22.2 arc90 48.42,22.38 47.56,22.38 arc-90 47.38,22.55 47.38,22.56 arc-90 47.56,22.74 48.42,22.74 arc90 48.6,22.91 48.6,22.93 arc90 48.42,23.1 47.56,23.1 arc-90 47.38,23.27 47.38,23.29 arc-90 47.56,23.46 47.81,23.46 arc90 47.99,23.64 47.99,23.86 47.77,24.08 46.82,24.08 46.24,24.66 39.99,24.66 39.45,24.12 39.45,23.6 39.89,23.16 v39.89,22.89
SRAM_A4  (via drill 0.2)
  Top 0.254: U10.B4 v50.91,20.81
  Top 0.406: U8.H4 v37.11,20.89
  Route3 0.1: v50.91,20.81 50.51,20.41 50.51,19.85 50.93,19.42 54.71,19.42 55.03,19.1 55.03,18.9 arc90 55.2,18.72 55.6,18.72 arc-90 55.77,18.55 55.77,18.48 arc-90 55.6,18.31 55.2,18.31 arc90 55.03,18.13 55.03,18.07 arc90 55.2,17.89 55.6,17.89 arc-90 55.77,17.72 55.77,17.65 arc-90 55.6,17.48 55.2,17.48 arc90 55.03,17.3 55.03,17.1 54.86,16.93 45.74,16.93 45.54,17.13 45.54,19.3 45.37,19.47 38.07,19.47 37.79,19.75 37.79,21.13 37.64,21.28 37.24,21.28 37.11,21.15 v37.11,20.89
SRAM_A5  (via drill 0.2)
  Top 0.254: U10.C3 v52.29,21.56
  Top 0.406: U8.F3 v39.89,21.89
  Route2 0.1: v52.29,21.56 52.29,21.3 51.63,20.64 51.63,19.53 51.21,19.11 49.46,19.11 48.81,19.76 48.81,25.17 48.55,25.43 48.32,25.43 arc-90 48.15,25.61 48.15,26.22 arc90 47.97,26.39 47.95,26.39 arc90 47.78,26.22 47.78,24.64 arc-90 47.6,24.47 47.59,24.47 arc-90 47.41,24.64 47.41,26.22 arc90 47.24,26.39 47.23,26.39 arc90 47.05,26.22 47.05,24.64 arc-90 46.88,24.47 46.86,24.47 arc-90 46.69,24.64 46.69,26.22 arc90 46.51,26.39 46.49,26.39 arc90 46.32,26.22 46.32,25.61 arc-90 46.15,25.43 45.75,25.43 45.18,24.86 39.81,24.86 39.25,24.3 39.25,22.8 39.89,22.16 v39.89,21.89
SRAM_A6  (via drill 0.2)
  Top 0.254: U10.C4 v50.91,21.56
  Top 0.406: U8.H1 v37.11,23.89
  Route3 0.1: v50.91,21.56 50.65,21.56 50.3,21.91 49.3,21.91 48.96,22.25 48.96,23.01 48.28,23.69 47.96,23.69 arc90 47.78,23.52 47.78,22.66 arc-90 47.61,22.48 47.56,22.48 arc-90 47.38,22.66 47.38,23.52 arc90 47.21,23.69 47.16,23.69 arc90 46.99,23.52 46.99,22.66 arc-90 46.81,22.48 46.76,22.48 arc-90 46.59,22.66 46.59,23.52 arc90 46.41,23.69 46.36,23.69 arc90 46.19,23.52 46.19,22.66 arc-90 46.01,22.48 45.96,22.48 arc-90 45.79,22.66 45.79,23.52 arc90 45.61,23.69 45.38,23.69 44.96,23.27 44.88,23.27 arc90 44.7,23.09 44.7,22.64 arc-90 44.53,22.46 44.46,22.46 arc-90 44.29,22.64 44.29,23.09 arc90 44.11,23.27 44.11,23.27 arc-90 43.94,23.45 43.94,24.8 arc90 43.76,24.97 43.7,24.97 arc90 43.53,24.8 43.53,23.45 arc-90 43.35,23.27 43.29,23.27 arc-90 43.12,23.45 43.12,24.8 arc90 42.94,24.97 42.88,24.97 arc90 42.71,24.8 42.71,23.45 arc-90 42.53,23.27 42.47,23.27 arc-90 42.3,23.45 42.3,24.05 arc90 42.12,24.23 42.09,24.23 arc90 41.91,24.05 41.91,23.45 arc-90 41.74,23.27 41.65,23.27 41.39,23.01 41.39,22.73 41.1,22.44 39.83,22.44 39.03,23.24 38.34,23.24 37.36,24.22 37.2,24.22 37.11,24.13 v37.11,23.89
SRAM_A7  (via drill 0.2)
  Top 0.254: U10.D4 v50.91,22.31
  Top 0.406: U8.G1 v38.89,23.89
  Route3 0.1: v50.91,22.31 50.26,22.96 49.58,22.96 48.66,23.88 48.66,25.51 48.27,25.9 45.99,25.9 45.27,26.61 42.98,26.61 arc90 42.8,26.43 42.8,25.56 arc-90 42.63,25.39 42.62,25.39 arc-90 42.45,25.56 42.45,26.43 arc90 42.27,26.61 42.27,26.61 arc90 42.09,26.43 42.09,25.56 arc-90 41.91,25.39 41.91,25.39 arc-90 41.73,25.56 41.73,26.43 arc90 41.56,26.61 41.55,26.61 arc90 41.38,26.43 41.38,25.56 arc-90 41.2,25.39 41.19,25.39 arc-90 41.02,25.56 41.02,26.43 arc90 40.84,26.61 40.84,26.61 arc90 40.66,26.43 40.66,25.56 arc-90 40.48,25.39 40.48,25.39 arc-90 40.3,25.56 40.3,26.43 arc90 40.13,26.61 40.12,26.61 arc90 39.95,26.43 39.95,25.56 arc-90 39.77,25.39 39.76,25.39 arc-90 39.59,25.56 39.59,26.43 arc90 39.41,26.61 39.41,26.61 arc90 39.23,26.43 39.23,25.56 arc-90 39.05,25.39 39.05,25.39 arc-90 38.87,25.56 38.87,26.43 arc90 38.7,26.61 38.53,26.61 38.37,26.45 38.37,25.24 38.13,25 37.77,25 37.57,24.8 37.57,24.42 37.7,24.29 38.78,24.29 38.89,24.18 v38.89,23.89
SRAM_A8  (via drill 0.2)
  Top 0.254: U10.H2 v53.04,25.94
  Top 0.406: U8.L3 v34.11,21.89
  Route2 0.1: v53.04,25.94 53.04,26.06 52,27.11 51.11,27.11 50.56,27.66 50.35,27.66 arc90 50.17,27.48 50.17,27.38 arc-90 50,27.2 49.98,27.2 arc-90 49.81,27.38 49.81,27.94 arc90 49.63,28.11 49.62,28.11 arc90 49.45,27.94 49.45,27.38 arc-90 49.27,27.2 49.26,27.2 arc-90 49.08,27.38 49.08,27.48 arc90 48.91,27.66 48.68,27.66 48.14,28.19 47.82,28.19 arc90 47.65,28.02 47.65,27.8 arc-90 47.47,27.63 | v34.11,21.89 33.67,22.33 33.67,24.36 33.85,24.54 33.85,27.39 34.65,28.19 44.32,28.19 arc-90 44.49,28.02 44.49,27.8 arc90 44.67,27.63 | 47.47,27.63 | 47.47,27.63 arc-90 47.3,27.8 47.3,28.02 arc90 47.12,28.19 47.12,28.19 arc90 46.95,28.02 46.95,27.8 arc-90 46.77,27.63 | 46.77,27.63 | 46.77,27.63 arc-90 46.6,27.8 46.6,28.02 arc90 46.42,28.19 46.42,28.19 arc90 46.25,28.02 46.25,27.8 arc-90 46.07,27.63 | 46.07,27.63 | 46.07,27.63 arc-90 45.9,27.8 45.9,28.02 arc90 45.72,28.19 45.72,28.19 arc90 45.55,28.02 45.55,27.8 arc-90 45.37,27.63 | 45.37,27.63 | 45.37,27.63 arc-90 45.2,27.8 45.2,28.02 arc90 45.02,28.19 45.02,28.19 arc90 44.84,28.02 44.84,27.8 arc-90 44.67,27.63 | 44.67,27.63
SRAM_A9  (via drill 0.2)
  Top 0.254: U10.H3 v52.29,25.94
  Top 0.406: U8.L2 v34.11,22.89